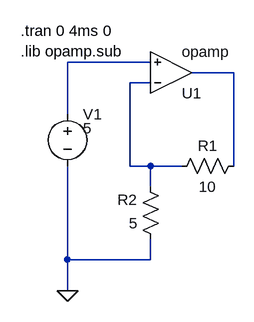
[diagram p0: schematic OpAmp_Simple.asc]
OpAmp_Simple.asc, the LTspice schematic file:
Version 4
SHEET 1 1148 688
WIRE 768 304 640 304
WIRE 896 320 832 320
WIRE 768 336 736 336
WIRE 640 384 640 304
WIRE 736 464 736 336
WIRE 768 464 736 464
WIRE 816 464 768 464
WIRE 896 464 896 320
WIRE 768 496 768 464
WIRE 640 608 640 464
WIRE 768 608 768 576
WIRE 768 608 640 608
WIRE 640 656 640 608
FLAG 640 656 0
SYMBOL voltage 640 368 R0
WINDOW 3 24 38 Left 2
SYMATTR InstName V1
SYMATTR Value 5
SYMBOL res 912 448 R90
WINDOW 0 0 56 VBottom 2
WINDOW 3 32 56 VTop 2
SYMATTR InstName R1
SYMATTR Value 10
SYMBOL res 784 592 R180
WINDOW 0 36 76 Left 2
WINDOW 3 36 40 Left 2
SYMATTR InstName R2
SYMATTR Value 5
SYMBOL Opamps/opamp 800 384 M180
SYMATTR InstName U1
TEXT 568 256 Left 2 !.tran 0 4ms 0\n.lib opamp.sub

The netlist it stands for:
* OpAmp_Simple.asc
V1 N001 0 5
R1 N002 N003 10
R2 0 N003 5
XU1 N003 N001 N002 opamp Aol=100K GBW=10Meg  ; pins invin noninvin out
.tran 0 4ms 0
.lib opamp.sub
.backanno
.end